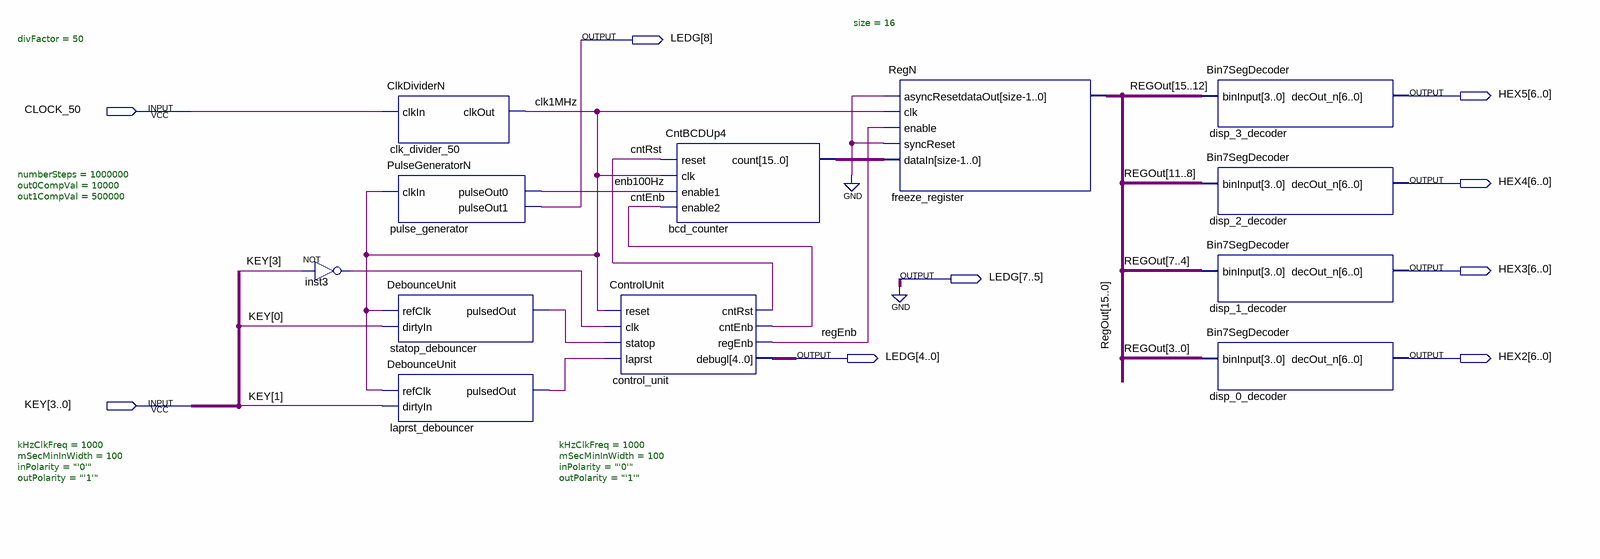
[diagram p0: schematic sheet]
// Quartus schematic Chronometer.bdf as structural Verilog: 12 symbols, 9 pins
module Chronometer (
  input  CLOCK_50,
  input  [3:0] KEY,
  output [8:0] LEDG,
  output [6:0] HEX5,
  output [6:0] HEX4,
  output [6:0] HEX3,
  output [6:0] HEX2
);

  wire clk1MHz, cntEnb, cntRst, enb100Hz, inst3_out, laprst_debouncer_pulsedout, regEnb,
       statop_debouncer_pulsedout;
  wire [15:0] bcd_counter_count, REGOut;

  not inst3 (inst3_out, KEY[3]);
  ClkDividerN #(.divFactor(50)) clk_divider_50 (.clkIn(CLOCK_50), .clkOut(clk1MHz));
  PulseGeneratorN #(.numberSteps(1000000), .out0CompVal(10000), .out1CompVal(500000)) pulse_generator (
    .clkIn(clk1MHz), .pulseOut0(enb100Hz), .pulseOut1(LEDG[8]));
  DebounceUnit #(.kHzClkFreq(1000), .mSecMinInWidth(100), .inPolarity("'0'"), .outPolarity("'1'")) statop_debouncer (
    .refClk(clk1MHz), .dirtyIn(KEY[0]), .pulsedOut(statop_debouncer_pulsedout));
  DebounceUnit #(.kHzClkFreq(1000), .mSecMinInWidth(100), .inPolarity("'0'"), .outPolarity("'1'")) laprst_debouncer (
    .refClk(clk1MHz), .dirtyIn(KEY[1]), .pulsedOut(laprst_debouncer_pulsedout));
  ControlUnit control_unit (
    .reset(clk1MHz), .clk(inst3_out), .statop(statop_debouncer_pulsedout),
    .laprst(laprst_debouncer_pulsedout), .cntRst(cntRst), .cntEnb(cntEnb), .regEnb(regEnb), .debugl(LEDG[4:0]));
  CntBCDUp4 bcd_counter (
    .reset(cntRst), .clk(clk1MHz), .enable1(enb100Hz), .enable2(cntEnb), .count(bcd_counter_count));
  RegN #(.size(16)) freeze_register (
    .asyncReset(1'b0), .clk(clk1MHz), .enable(regEnb), .syncReset(1'b0), .dataIn(bcd_counter_count),
    .dataOut(REGOut));
  Bin7SegDecoder disp_3_decoder (.binInput(REGOut[15:12]), .decOut_n(HEX5));
  Bin7SegDecoder disp_2_decoder (.binInput(REGOut[11:8]), .decOut_n(HEX4));
  Bin7SegDecoder disp_1_decoder (.binInput(REGOut[7:4]), .decOut_n(HEX3));
  Bin7SegDecoder disp_0_decoder (.binInput(REGOut[3:0]), .decOut_n(HEX2));

  assign LEDG[7:5] = 3'b000;
endmodule
